# Altium schematic sheet POWER_GEN.SchDoc: =project_title
size Tabloid; CompanyName: Luxonis Holding; Organization: Luxonis Holding; Address1: 1925 Harmony Park Drive; Address2: Westminster, CO; Address3: 80234; Address4: United States; SheetNumber: 12; SheetTotal: 12
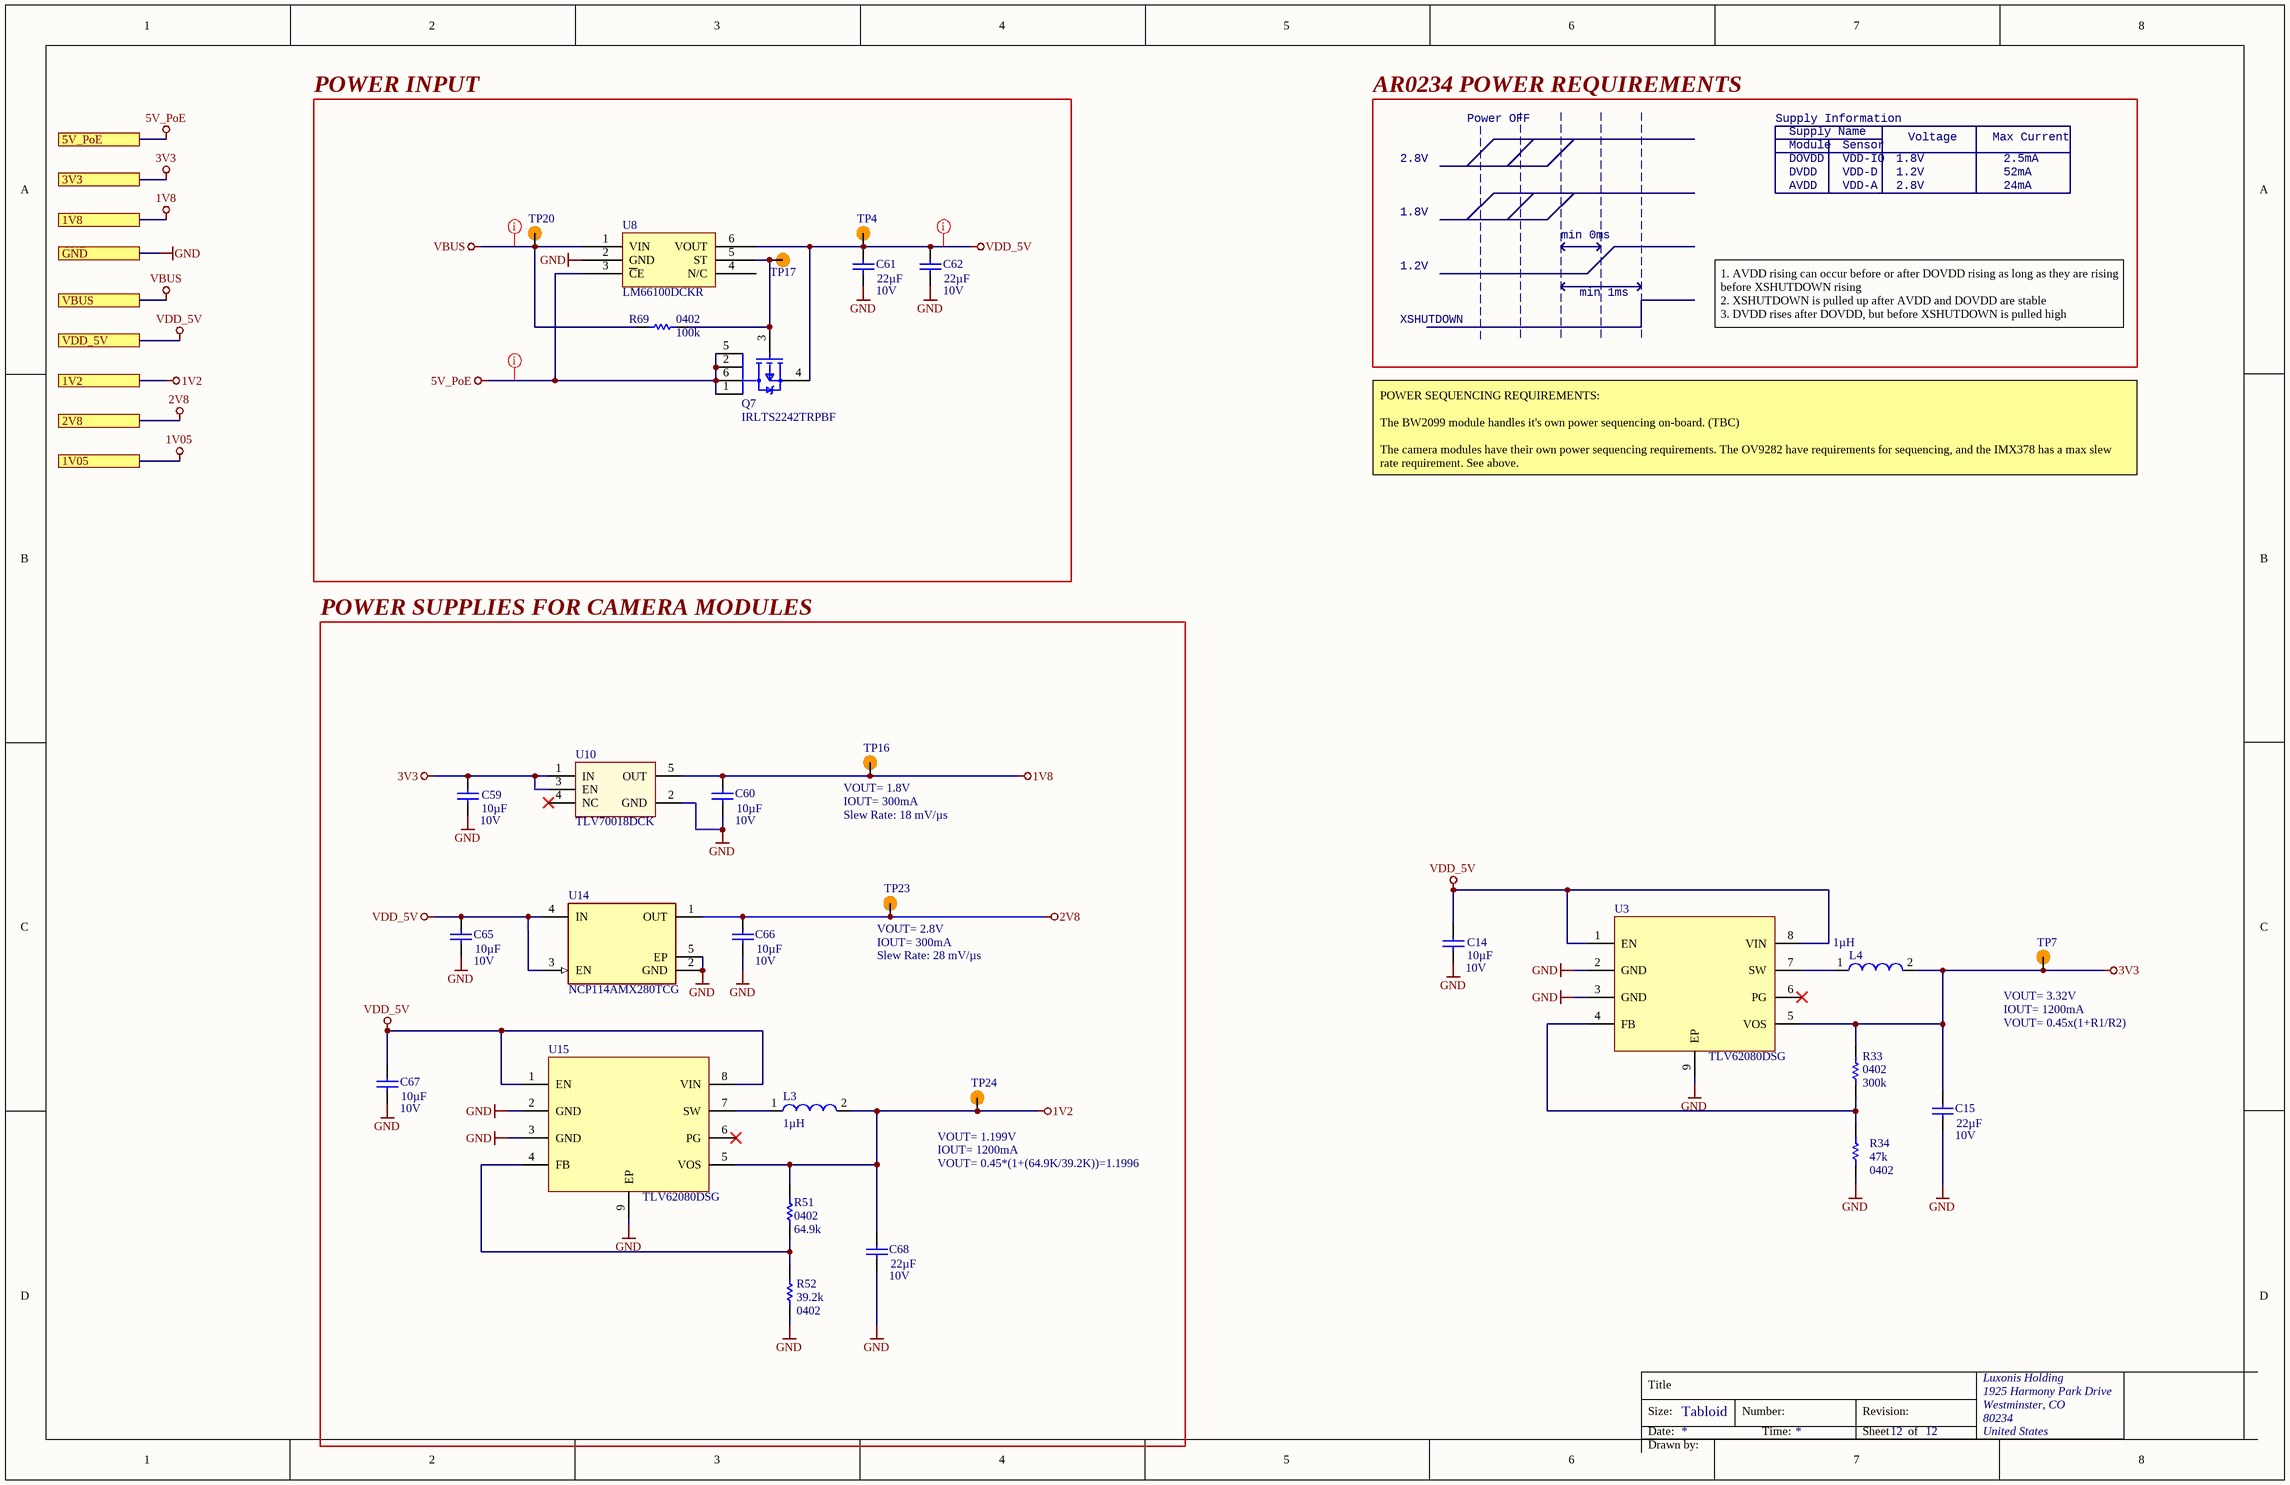
[diagram p0: POWER_GEN.SchDoc]

## Parts
C14  value 10µF  Voltage Rating: 10V  [CAPC0603(1608)100_L]  (hidden comment: GRM188R61A106ME69D)
C15  value 22µF  Voltage Rating: 10V  [CAPC0603(1608)100_L]  (hidden comment: GRM188R61A226ME15D)
C59  value 10µF  Voltage Rating: 10V  [CAPC0603(1608)100_L]  (hidden comment: GRM188R61A106ME69D)
C60  value 10µF  Voltage Rating: 10V  [CAPC0603(1608)100_L]  (hidden comment: GRM188R61A106ME69D)
C61  value 22µF  Voltage Rating: 10V  [CAPC0603(1608)100_L]  (hidden comment: GRM188R61A226ME15D)
C62  value 22µF  Voltage Rating: 10V  [CAPC0603(1608)100_L]  (hidden comment: GRM188R61A226ME15D)
C65  value 10µF  Voltage Rating: 10V  [CAPC0603(1608)100_L]  (hidden comment: GRM188R61A106ME69D)
C66  value 10µF  Voltage Rating: 10V  [CAPC0603(1608)100_L]  (hidden comment: GRM188R61A106ME69D)
C67  value 10µF  Voltage Rating: 10V  [CAPC0603(1608)100_L]  (hidden comment: GRM188R61A106ME69D)
C68  value 22µF  Voltage Rating: 10V  [CAPC0603(1608)100_L]  (hidden comment: GRM188R61A226ME15D)
L3  value 1µH  [DFE252012P-1R0M=P2]  (hidden comment: DFE252012P-1R0M=P2)
L4  value 1µH  [DFE252012P-1R0M=P2]  (hidden comment: DFE252012P-1R0M=P2)
Q7  IRLTS2242TRPBF  [TSOP-6-MFG]
R33  value 300k  Case/Package: 0402  [RESC0402(1005)_L]  (hidden comment: RC0402FR-07300KL)
R34  value 47k  Case/Package: 0402  [RESC0402(1005)_L]  (hidden comment: RC0402FR-0747KL)
R51  value 64.9k  Case/Package: 0402  [RESC0402(1005)_L]  (hidden comment: ERJ-2RKF6492X)
R52  value 39.2k  Case/Package: 0402  [RESC0402(1005)_L]  (hidden comment: CRCW040239K2FKED)
R69  value 100k  Case/Package: 0402  [RESC0402(1005)_L]  (hidden comment: RC0402FR-07100KL)
TP4  TEST_POINT  [TP100_200_NS]  (value not drawn)  (no BOM)
TP7  TEST_POINT  [TP100_200_NS]  (value not drawn)  (no BOM)
TP16  TEST_POINT  [TP100_200_NS]  (value not drawn)  (no BOM)
TP17  TEST_POINT  [TP100_200_NS]  (value not drawn)  (no BOM)
TP20  TEST_POINT  [TP100_200_NS]  (value not drawn)  (no BOM)
TP23  TEST_POINT  [TP100_200_NS]  (value not drawn)  (no BOM)
TP24  TEST_POINT  [TP100_200_NS]  (value not drawn)  (no BOM)
U3  TLV62080DSG  [TLV62080DSG]
U8  LM66100DCKR  [LM66100DCKR]
U10  TLV70018DCK  [TLV70018DCK]
U14  NCP114AMX280TCG  [FP-517CU-MFG]
U15  TLV62080DSG  [TLV62080DSG]

## Blocks framed on the sheet
POWER INPUT: C61 C62 Q7 R69 TP4 TP17 TP20 U8
POWER SUPPLIES FOR CAMERA MODULES: C59 C60 C65-C68 L3 R51 R52 TP16 TP23 TP24 U10 U14 U15

## Ports
1V2, 1V05, 1V8, 2V8, 3V3, 5V_PoE, GND, VBUS, VDD_5V

## Nets
1V2: C68.2 L3.2 R51.2 TP24.1 U15.5(VOS) ; port 1V2
1V05: port 1V05
1V8: C60.2 TP16.1 U10.5(OUT) ; port 1V8
2V8: C66.2 TP23.1 U14.1(OUT) ; port 2V8
3V3: C15.2 C59.2 L4.2 R33.2 TP7.1 U3.5(VOS) U10.1(IN) U10.3(EN) ; port 3V3
5V_PoE: Q7.1(D) Q7.2(D) Q7.5(D) Q7.6(D) U8.3(~{C}E) ; port 5V_PoE
GND: C14.1 C15.1 C59.1 C60.1 C61.2 C62.2 C65.1 C66.1 C67.1 C68.1 R34.1 R52.1 U3.2(GND) U3.3(GND) U3.9(EP) U8.2(GND) U10.2(GND) U14.2(GND) U14.5(EP) U15.2(GND) U15.3(GND) U15.9(EP) ; port GND
VBUS: R69.2 TP20.1 U8.1(VIN) ; port VBUS
VDD_5V: C14.2 C61.1 C62.1 C65.2 C67.2 Q7.4(S) TP4.1 U3.1(EN) U3.8(VIN) U8.6(VOUT) U14.3(EN) U14.4(IN) U15.1(EN) U15.8(VIN) ; port VDD_5V
NetL3_1: L3.1 U15.7(SW)
NetL4_1: L4.1 U3.7(SW)
NetQ7_3: Q7.3(G) R69.1 TP17.1 U8.5(ST)
NetR33_1: R33.1 R34.2 U3.4(FB)
NetR51_1: R51.1 R52.2 U15.4(FB)

Not connected (* = marked no-connect by the designer): U3 6(PG)*; U8 4(N/C); U10 4(NC)*; U15 6(PG)*

## Layout directives
net class Power_trace: 5V_PoE, VBUS, VDD_5V

## Notes on the sheet
- AR0234 POWER REQUIREMENTS
- 2.8V
- Power OFF
- Supply Information
- DOVDD
- Supply Name
- Module
- VDD-IO
- Sensor
- 1.8V
- Voltage
- Max Current
- 2.5mA
- AVDD
- DVDD
- VDD-A
- VDD-D
- 1.2V
- 24mA
- 52mA
- min 0ms
- min 1ms
- XSHUTDOWN
- 1. AVDD rising can occur before or after DOVDD rising as long as they are rising before XSHUTDOWN rising
  2. XSHUTDOWN is pulled up after AVDD and DOVDD are stable
  3. DVDD rises after DOVDD, but before XSHUTDOWN is pulled high
- POWER SEQUENCING REQUIREMENTS:
  The BW2099 module handles it's own power sequencing on-board. (TBC)
  The camera modules have their own power sequencing requirements. The OV9282 have requirements for sequencing, and the IMX378 has a max slew rate requirement. See above.
- (near TP16) VOUT= 1.8V
- (near TP16) IOUT= 300mA
- (near TP16) Slew Rate: 18 mV/µs
- (near TP23) VOUT= 2.8V
- (near TP23) IOUT= 300mA
- (near TP23) Slew Rate: 28 mV/µs
- (near TP7) VOUT= 3.32V
- (near TP7) IOUT= 1200mA
- VOUT= 0.45x(1+R1/R2)
- (near TP24) VOUT= 1.199V
- (near TP24) IOUT= 1200mA
- VOUT= 0.45*(1+(64.9K/39.2K))=1.1996
- Title
- Size:
- Date:
- Tabloid
- Number:
- Time:
- Revision:
- Sheet
- of
- Drawn by:

## Library data of the parts
C14 C59 C60 C65-C67 = CMP-004-000018-4: CAP CER 10UF 10V X5R 0603 20%; Manufacturer 1: Murata; Manufacturer Part Number 1: GRM188R61A106ME69D; Case/Package: 0603; Min Operating Temperature: -55°C; Max Operating Temperature: 85°C; Tolerance: 20%; Dielectric: X5R; Length: 1.6mm; Height: 0.8mm; Width: 0.8mm; Depth: 0.8mm; ComponentLink1URL: http://www.mouser.com/ds/2/281/c02e-2905.pdf?src-supplier=Mouser; ComponentLink1Description: http://www.mouser.com/ds/2/281/c02e-2905.pdf?src-supplier=Mouser; ComponentLink2URL: http://components.arrow.com/part/dataview/0323_06119472?src-supplier=Arrow+Europe; ComponentLink2Description: http://components.arrow.com/part/dataview/0323_06119472?src-supplier=Arrow+Europe; ComponentLink3URL: http://www.farnell.com/datasheets/2048014.pdf?src-supplier=Farnell; ComponentLink3Description: http://www.farnell.com/datasheets/2048014.pdf?src-supplier=Farnell; ComponentLink4URL: http://www.farnell.com/datasheets/1872210.pdf?src-supplier=Farnell; ComponentLink4Description: http://www.farnell.com/datasheets/1872210.pdf?src-supplier=Farnell; ComponentLink5URL: http://search.murata.co.jp/Ceramy/image/img/A01X/G101/ENG/GRM188R61A106ME69-01.pdf?src-supplier=Digi-Key; ComponentLink5Description: http://search.murata.co.jp/Ceramy/image/img/A01X/G101/ENG/GRM188R61A106ME69-01.pdf?src-supplier=Digi-Key; ComponentLink6URL: http://www.farnell.com/datasheets/1872210.pdf?src-supplier=Newark; ComponentLink6Description: http://www.farnell.com/datasheets/1872210.pdf?src-supplier=Newark; ComponentLink7URL: http://www.farnell.com/datasheets/2048014.pdf?src-supplier=Element14; ComponentLink7Description: http://www.farnell.com/datasheets/2048014.pdf?src-supplier=Element14; ComponentLink8URL: http://www.farnell.com/datasheets/2048014.pdf?src-supplier=Newark; ComponentLink8Description: http://www.farnell.com/datasheets/2048014.pdf?src-supplier=Newark; Design Item ID: GRM188R61A106ME69D; Mounting Technology: SMT
C15 C61 C62 C68 = CMP-108-000020-4: CAP CER 22UF 10V X5R 0603 20%; Manufacturer 1: Murata; ComponentLink1URL: https://datasheet.ciiva.com/46444/1769893-46444975.pdf?src-supplier=Element14; ComponentLink1Description: https://datasheet.ciiva.com/46444/1769893-46444975.pdf?src-supplier=Element14; Manufacturer Part Number 1: GRM188R61A226ME15D; Case/Package: 0603; Min Operating Temperature: -55°C; Max Operating Temperature: 85°C; Tolerance: 20%; Dielectric: X5R; Length: 1.6mm; Height: 0.8mm; Width: 0.8mm; Depth: 0.8mm; Design Item ID: GRM188R61A226ME15D; Mounting Technology: SMT
L3 L4 = CMP-082-000001-2: FIXED IND 1UH 3.2A 42 MOHM SMD; Manufacturer: Murata; Current Rating: 4.3A; Tolerance: 20%; Manufacturer Part Number: DFE252012P-1R0M=P2; Case/Package: 1008; Manufacturer 1: Murata; Manufacturer Part Number 1: DFE252012P-1R0M=P2; Manufacturer 2: Murata; Manufacturer Part Number 2: DFE252012P-1R0M=P2; Manufacturer 3: Murata; Manufacturer Part Number 3: DFE252012P-1R0M=P2; Manufacturer 4: Murata; Manufacturer Part Number 4: DFE252012P-1R0M=P2
Q7 = CMP-016-000020-2: MOSFET P-CH 20V 6.9A 6TSOP; Manufacturer 1: Infineon; Max Drain to Source Voltage: -20V; Case/Package: TSOP; Manufacturer Part Number 1: IRLTS2242TRPBF; Design Item ID: IRLTS2242TRPBF; Continuous Drain Current: 6.9A
R33 = CMP-013-000049-8: RES SMD 300K OHM 1% 1/16W 0402; Manufacturer 1: Yageo; Power Rating: 63mW; Voltage Rating: 50V; Manufacturer Part Number 1: RC0402FR-07300KL; Min Operating Temperature: -55°C; Max Operating Temperature: 155°C; Tolerance: 1%; Design Item ID: RC0402FR-07300KL
R34 = CMP-013-000015-9: RES SMD 47K OHM 1% 1/16W 0402; Manufacturer 1: Yageo; Power Rating: 62.5mW; Voltage Rating: 50V; Manufacturer Part Number 1: RC0402FR-0747KL; Min Operating Temperature: -55°C; Max Operating Temperature: 155°C; Tolerance: 1%; Design Item ID: RC0402FR-0747KL
R51 = CMP-009-00246-3: RES SMD 64.9K OHM 1% 0.1W 0402; Manufacturer 1: Panasonic; Power Rating: 100mW; Voltage Rating: 50V; Manufacturer Part Number 1: ERJ-2RKF6492X; Tolerance: 1%
R52 = CMP-013-000027-8: RES SMD 39.2K OHM 1% 1/16W 0402; Manufacturer 1: Vishay; Power Rating: 63mW; Voltage Rating: 50V; Manufacturer Part Number 1: CRCW040239K2FKED; Min Operating Temperature: -55°C; Max Operating Temperature: 155°C; Tolerance: 1%; Design Item ID: CRCW040239K2FKED
R69 = CMP-013-000035-8: RES SMD 100K OHM 1% 1/16W 0402; Manufacturer 1: Yageo; Power Rating: 63mW; Voltage Rating: 50V; Manufacturer Part Number 1: RC0402FR-07100KL; Min Operating Temperature: -55°C; Max Operating Temperature: 155°C; Tolerance: 1%; Design Item ID: RC0402FR-07100KL
TP4 TP7 TP16 TP17 TP20 TP23 TP24 = CMP-015-000000-2: Manufacturer Part Number 1: /; Design Item ID: TEST_POINT; Source: LuxonisMaster.SchLib
U3 U15 = CMP-010-000007-3: IC REG BUCK ADJ 1.2A SYNC 8WSON; Manufacturer 1: Texas Instruments; Manufacturer Part Number 1: TLV62080DSGR; Output Voltage: 4V; Min Supply Voltage: 2.5V; Min Output Voltage: 500mV; Max Supply Voltage: 5.5V; Vfb/Vout: 0V; Min Operating Temperature: -40°C; Max Operating Temperature: 125°C; Max Output Current: 1.2A; Max Output Voltage: 4V
U8 = CMP-099-000001-2: IC OR CTRLR IDEAL DIODE SC70-6; Manufacturer 1: Texas Instruments; Manufacturer Part Number 1: LM66100DCKR
U10 = CMP-113-000003-2: IC REG LINEAR 1.8V 200MA SC70-5 Linear Voltage Regulator IC  1 Output  200mA SC-70-5; Manufacturer 1: Texas Instruments; Manufacturer Part Number 1: TLV70018DCKR; Max Supply Voltage: 5.5V; Min Supply Voltage: 2V; Case/Package: SC; Min Operating Temperature: -40°C; Max Operating Temperature: 125°C; Max Output Current: 200mA; Max Output Voltage: 1.8V; Min Output Voltage: 1.8V; Pins: 5
U14 = CMP-019-00053-3: Fixed Positive LDO Regulator, 2.8V, 0.23V Dropout, CMOS, PDSO4; Manufacturer 1: OnSemi; Max Supply Voltage: 5.5V; Min Supply Voltage: 1.7V; Max Output Current: 300mA; Vfb/Vout: 0V; Pins: 5; Output Voltage: 2.8V; Manufacturer Part Number 1: NCP114AMX280TCG; Case/Package: UDFN-4